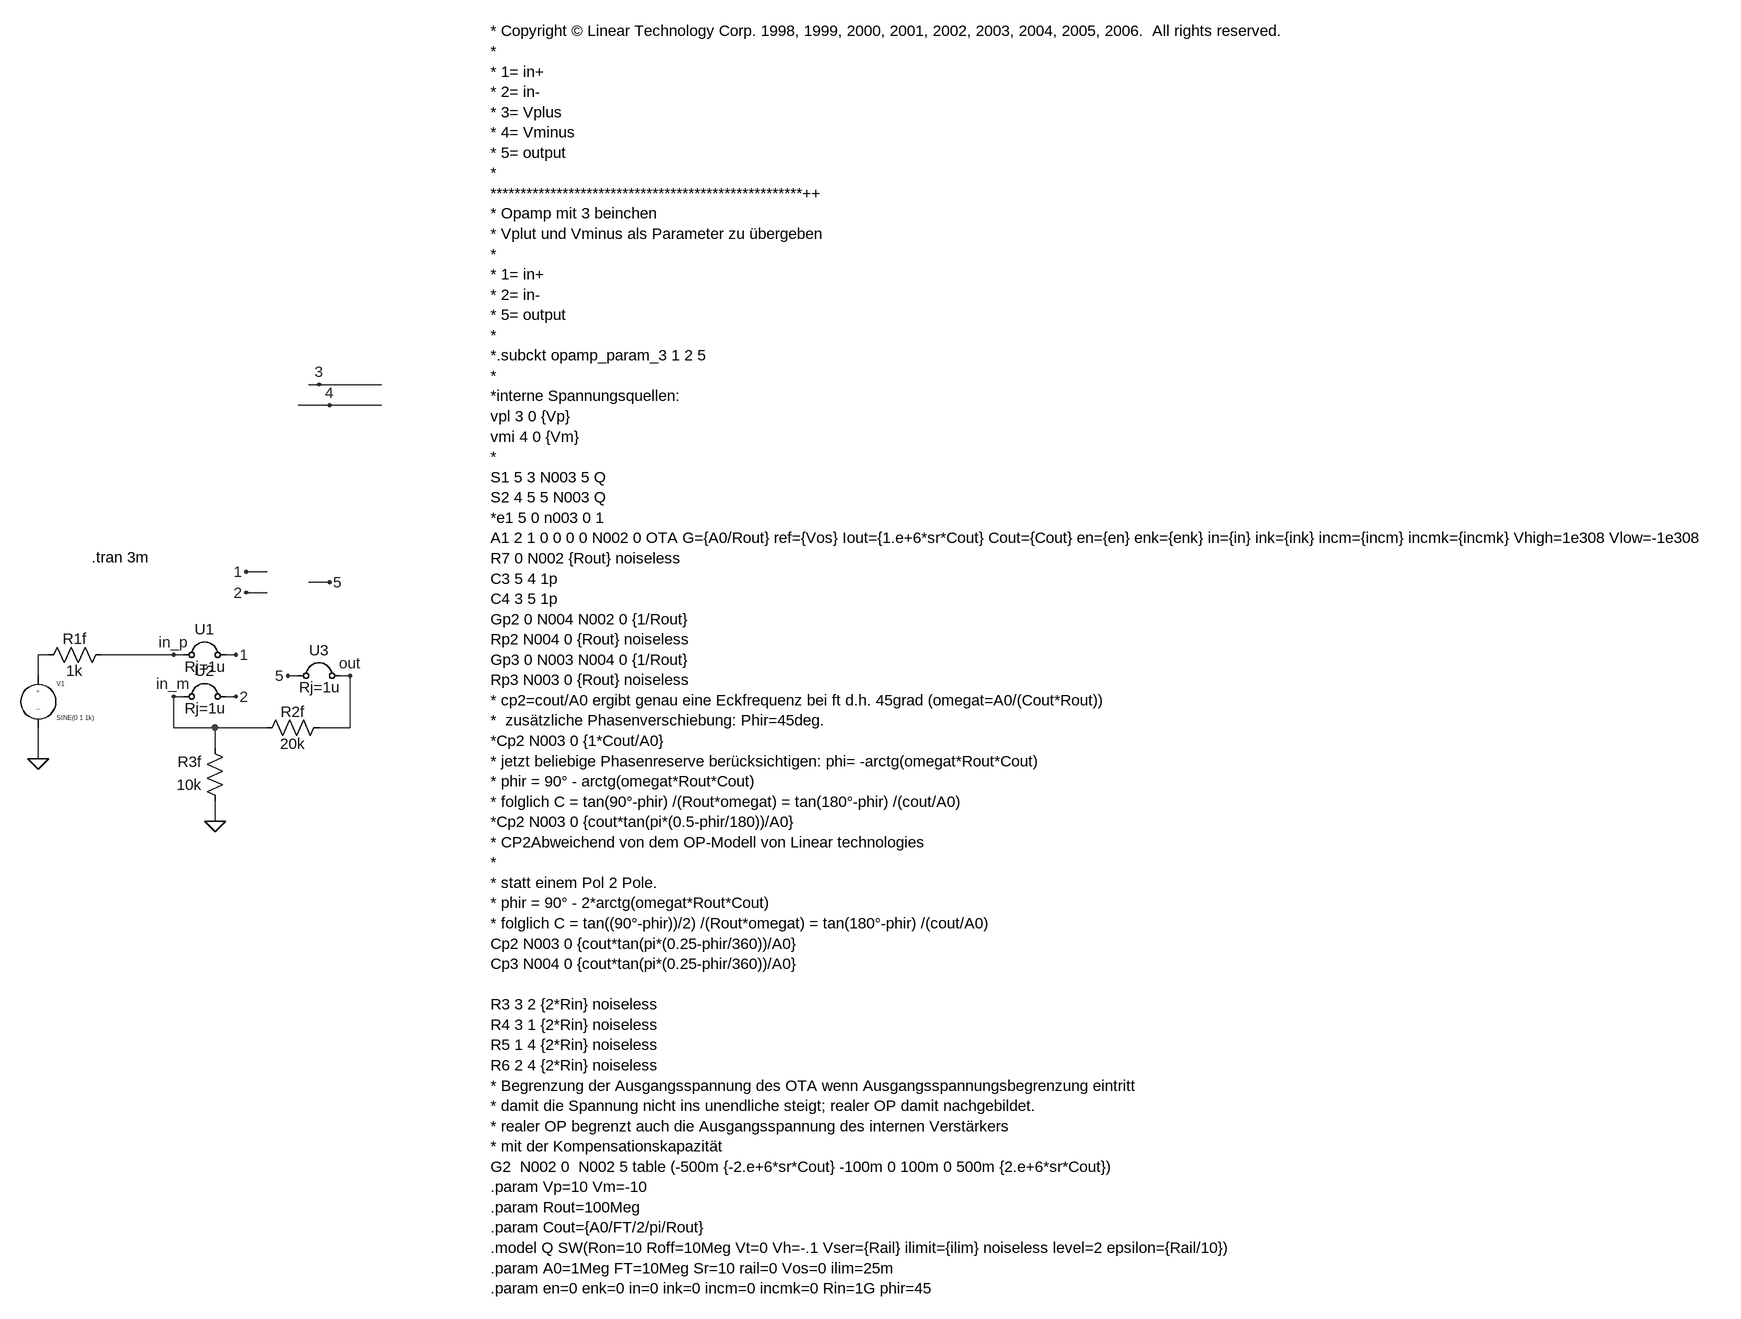
[diagram p0: schematic op_macro_netlist_conn.asc]
op_macro_netlist_conn.asc, the LTspice schematic file:
Version 4
SHEET 1 1900 1736
WIRE -288 128 -304 128
WIRE -192 128 -288 128
WIRE -272 160 -320 160
WIRE -192 160 -272 160
WIRE -368 416 -400 416
WIRE -272 432 -304 432
WIRE -368 448 -400 448
WIRE -704 544 -720 544
WIRE -512 544 -624 544
WIRE -496 544 -512 544
WIRE -416 544 -432 544
WIRE -720 576 -720 544
WIRE -320 576 -336 576
WIRE -240 576 -256 576
WIRE -496 608 -512 608
WIRE -416 608 -432 608
WIRE -512 656 -512 608
WIRE -448 656 -512 656
WIRE -368 656 -448 656
WIRE -240 656 -240 576
WIRE -240 656 -288 656
WIRE -448 688 -448 656
WIRE -720 704 -720 656
WIRE -448 800 -448 768
FLAG -720 704 0
FLAG -416 544 1
FLAG -416 608 2
FLAG -512 544 in_p
FLAG -512 608 in_m
FLAG -336 576 5
FLAG -240 576 out
FLAG -448 800 0
FLAG -400 416 1
FLAG -400 448 2
FLAG -272 432 5
FLAG -288 128 3
FLAG -272 160 4
SYMBOL source-V -720 560 R0
WINDOW 123 0 0 Left 2
WINDOW 39 0 0 Left 2
SYMATTR InstName V1
SYMATTR Value SINE(0 1 1k)
SYMBOL res -720 560 R270
WINDOW 0 25 56 VTop 2
WINDOW 3 7 56 VBottom 2
SYMATTR InstName R1f
SYMATTR Value 1k
SYMBOL MDB_sym\\jumperRes -464 480 R0
SYMATTR InstName U1
SYMBOL MDB_sym\\jumperRes -464 544 R0
SYMATTR InstName U2
SYMBOL MDB_sym\\jumperRes -288 512 R0
SYMATTR InstName U3
SYMBOL res -272 640 R90
WINDOW 0 7 56 VBottom 2
WINDOW 3 25 56 VTop 2
SYMATTR InstName R2f
SYMATTR Value 20k
SYMBOL res -432 784 R180
WINDOW 0 36 76 Left 2
WINDOW 3 36 40 Left 2
SYMATTR InstName R3f
SYMATTR Value 10k
TEXT -24 -416 Left 2 !* Copyright © Linear Technology Corp. 1998, 1999, 2000, 2001, 2002, 2003, 2004, 2005, 2006.  All rights reserved.\n*\n* 1= in+\n* 2= in-\n* 3= Vplus\n* 4= Vminus\n* 5= output\n*\n****************************************************++\n* Opamp mit 3 beinchen\n* Vplut und Vminus als Parameter zu übergeben\n*\n* 1= in+\n* 2= in-\n* 5= output\n*\n*.subckt opamp_param_3 1 2 5\n*\n*interne Spannungsquellen:\nvpl 3 0 {Vp}\nvmi 4 0 {Vm}\n*\nS1 5 3 N003 5 Q\nS2 4 5 5 N003 Q\n*e1 5 0 n003 0 1\nA1 2 1 0 0 0 0 N002 0 OTA G={A0/Rout} ref={Vos} Iout={1.e+6*sr*Cout} Cout={Cout} en={en} enk={enk} in={in} ink={ink} incm={incm} incmk={incmk} Vhigh=1e308 Vlow=-1e308\nR7 0 N002 {Rout} noiseless\nC3 5 4 1p\nC4 3 5 1p\nGp2 0 N004 N002 0 {1/Rout}\nRp2 N004 0 {Rout} noiseless\nGp3 0 N003 N004 0 {1/Rout}\nRp3 N003 0 {Rout} noiseless\n* cp2=cout/A0 ergibt genau eine Eckfrequenz bei ft d.h. 45grad (omegat=A0/(Cout*Rout))\n*  zusätzliche Phasenverschiebung: Phir=45deg.\n*Cp2 N003 0 {1*Cout/A0}\n* jetzt beliebige Phasenreserve berücksichtigen: phi= -arctg(omegat*Rout*Cout)\n* phir = 90° - arctg(omegat*Rout*Cout)\n* folglich C = tan(90°-phir) /(Rout*omegat) = tan(180°-phir) /(cout/A0)\n*Cp2 N003 0 {cout*tan(pi*(0.5-phir/180))/A0}\n* CP2Abweichend von dem OP-Modell von Linear technologies\n*\n* statt einem Pol 2 Pole.\n* phir = 90° - 2*arctg(omegat*Rout*Cout)\n* folglich C = tan((90°-phir))/2) /(Rout*omegat) = tan(180°-phir) /(cout/A0)\nCp2 N003 0 {cout*tan(pi*(0.25-phir/360))/A0}\nCp3 N004 0 {cout*tan(pi*(0.25-phir/360))/A0}\n \nR3 3 2 {2*Rin} noiseless\nR4 3 1 {2*Rin} noiseless\nR5 1 4 {2*Rin} noiseless\nR6 2 4 {2*Rin} noiseless\n* Begrenzung der Ausgangsspannung des OTA wenn Ausgangsspannungsbegrenzung eintritt\n* damit die Spannung nicht ins unendliche steigt; realer OP damit nachgebildet.\n* realer OP begrenzt auch die Ausgangsspannung des internen Verstärkers \n* mit der Kompensationskapazität\nG2  N002 0  N002 5 table (-500m {-2.e+6*sr*Cout} -100m 0 100m 0 500m {2.e+6*sr*Cout})\n.param Vp=10 Vm=-10\n.param Rout=100Meg\n.param Cout={A0/FT/2/pi/Rout}\n.model Q SW(Ron=10 Roff=10Meg Vt=0 Vh=-.1 Vser={Rail} ilimit={ilim} noiseless level=2 epsilon={Rail/10})\n.param A0=1Meg FT=10Meg Sr=10 rail=0 Vos=0 ilim=25m\n.param en=0 enk=0 in=0 ink=0 incm=0 incmk=0 Rin=1G phir=45
TEXT -638 394 Left 2 !.tran 3m

The netlist it stands for:
* op_macro_netlist_conn.asc
V1 N001 0 SINE(0 1 1k)
R1f N001 in_p 1k
XU1 in_p 1 jumperResistor Rin=1t Rout=1t Rj=1u  ; pins + -
XU2 in_m 2 jumperResistor Rin=1t Rout=1t Rj=1u  ; pins + -
XU3 5 out jumperResistor Rin=1t Rout=1t Rj=1u  ; pins + -
R2f out in_m 20k
R3f 0 in_m 10k
* Copyright © Linear Technology Corp. 1998, 1999, 2000, 2001, 2002, 2003, 2004, 2005, 2006.  All rights reserved.
*
* 1= in+
* 2= in-
* 3= Vplus
* 4= Vminus
* 5= output
*
****************************************************++
* Opamp mit 3 beinchen
* Vplut und Vminus als Parameter zu übergeben
*
* 1= in+
* 2= in-
* 5= output
*
*.subckt opamp_param_3 1 2 5
*
*interne Spannungsquellen:
vpl 3 0 {Vp}
vmi 4 0 {Vm}
*
S1 5 3 N003 5 Q
S2 4 5 5 N003 Q
*e1 5 0 n003 0 1
A1 2 1 0 0 0 0 N002 0 OTA G={A0/Rout} ref={Vos} Iout={1.e+6*sr*Cout} Cout={Cout} en={en} enk={enk} in={in} ink={ink} incm={incm} incmk={incmk} Vhigh=1e308 Vlow=-1e308
R7 0 N002 {Rout} noiseless
C3 5 4 1p
C4 3 5 1p
Gp2 0 N004 N002 0 {1/Rout}
Rp2 N004 0 {Rout} noiseless
Gp3 0 N003 N004 0 {1/Rout}
Rp3 N003 0 {Rout} noiseless
* cp2=cout/A0 ergibt genau eine Eckfrequenz bei ft d.h. 45grad (omegat=A0/(Cout*Rout))
*  zusätzliche Phasenverschiebung: Phir=45deg.
*Cp2 N003 0 {1*Cout/A0}
* jetzt beliebige Phasenreserve berücksichtigen: phi= -arctg(omegat*Rout*Cout)
* phir = 90° - arctg(omegat*Rout*Cout)
* folglich C = tan(90°-phir) /(Rout*omegat) = tan(180°-phir) /(cout/A0)
*Cp2 N003 0 {cout*tan(pi*(0.5-phir/180))/A0}
* CP2Abweichend von dem OP-Modell von Linear technologies
*
* statt einem Pol 2 Pole.
* phir = 90° - 2*arctg(omegat*Rout*Cout)
* folglich C = tan((90°-phir))/2) /(Rout*omegat) = tan(180°-phir) /(cout/A0)
Cp2 N003 0 {cout*tan(pi*(0.25-phir/360))/A0}
Cp3 N004 0 {cout*tan(pi*(0.25-phir/360))/A0}
R3 3 2 {2*Rin} noiseless
R4 3 1 {2*Rin} noiseless
R5 1 4 {2*Rin} noiseless
R6 2 4 {2*Rin} noiseless
* Begrenzung der Ausgangsspannung des OTA wenn Ausgangsspannungsbegrenzung eintritt
* damit die Spannung nicht ins unendliche steigt; realer OP damit nachgebildet.
* realer OP begrenzt auch die Ausgangsspannung des internen Verstärkers
* mit der Kompensationskapazität
G2  N002 0  N002 5 table (-500m {-2.e+6*sr*Cout} -100m 0 100m 0 500m {2.e+6*sr*Cout})
.param Vp=10 Vm=-10
.param Rout=100Meg
.param Cout={A0/FT/2/pi/Rout}
.model Q SW(Ron=10 Roff=10Meg Vt=0 Vh=-.1 Vser={Rail} ilimit={ilim} noiseless level=2 epsilon={Rail/10})
.param A0=1Meg FT=10Meg Sr=10 rail=0 Vos=0 ilim=25m
.param en=0 enk=0 in=0 ink=0 incm=0 incmk=0 Rin=1G phir=45
.tran 3m
.lib MDB_sub/jumperRes.sub
.backanno
.end